# EAGLE schematic controller (EAGLE 6.6.0)
AUTHOR: Branden Ghena; REV: B; TITLE: Signpost Control Module

## Sheet 1 of 5
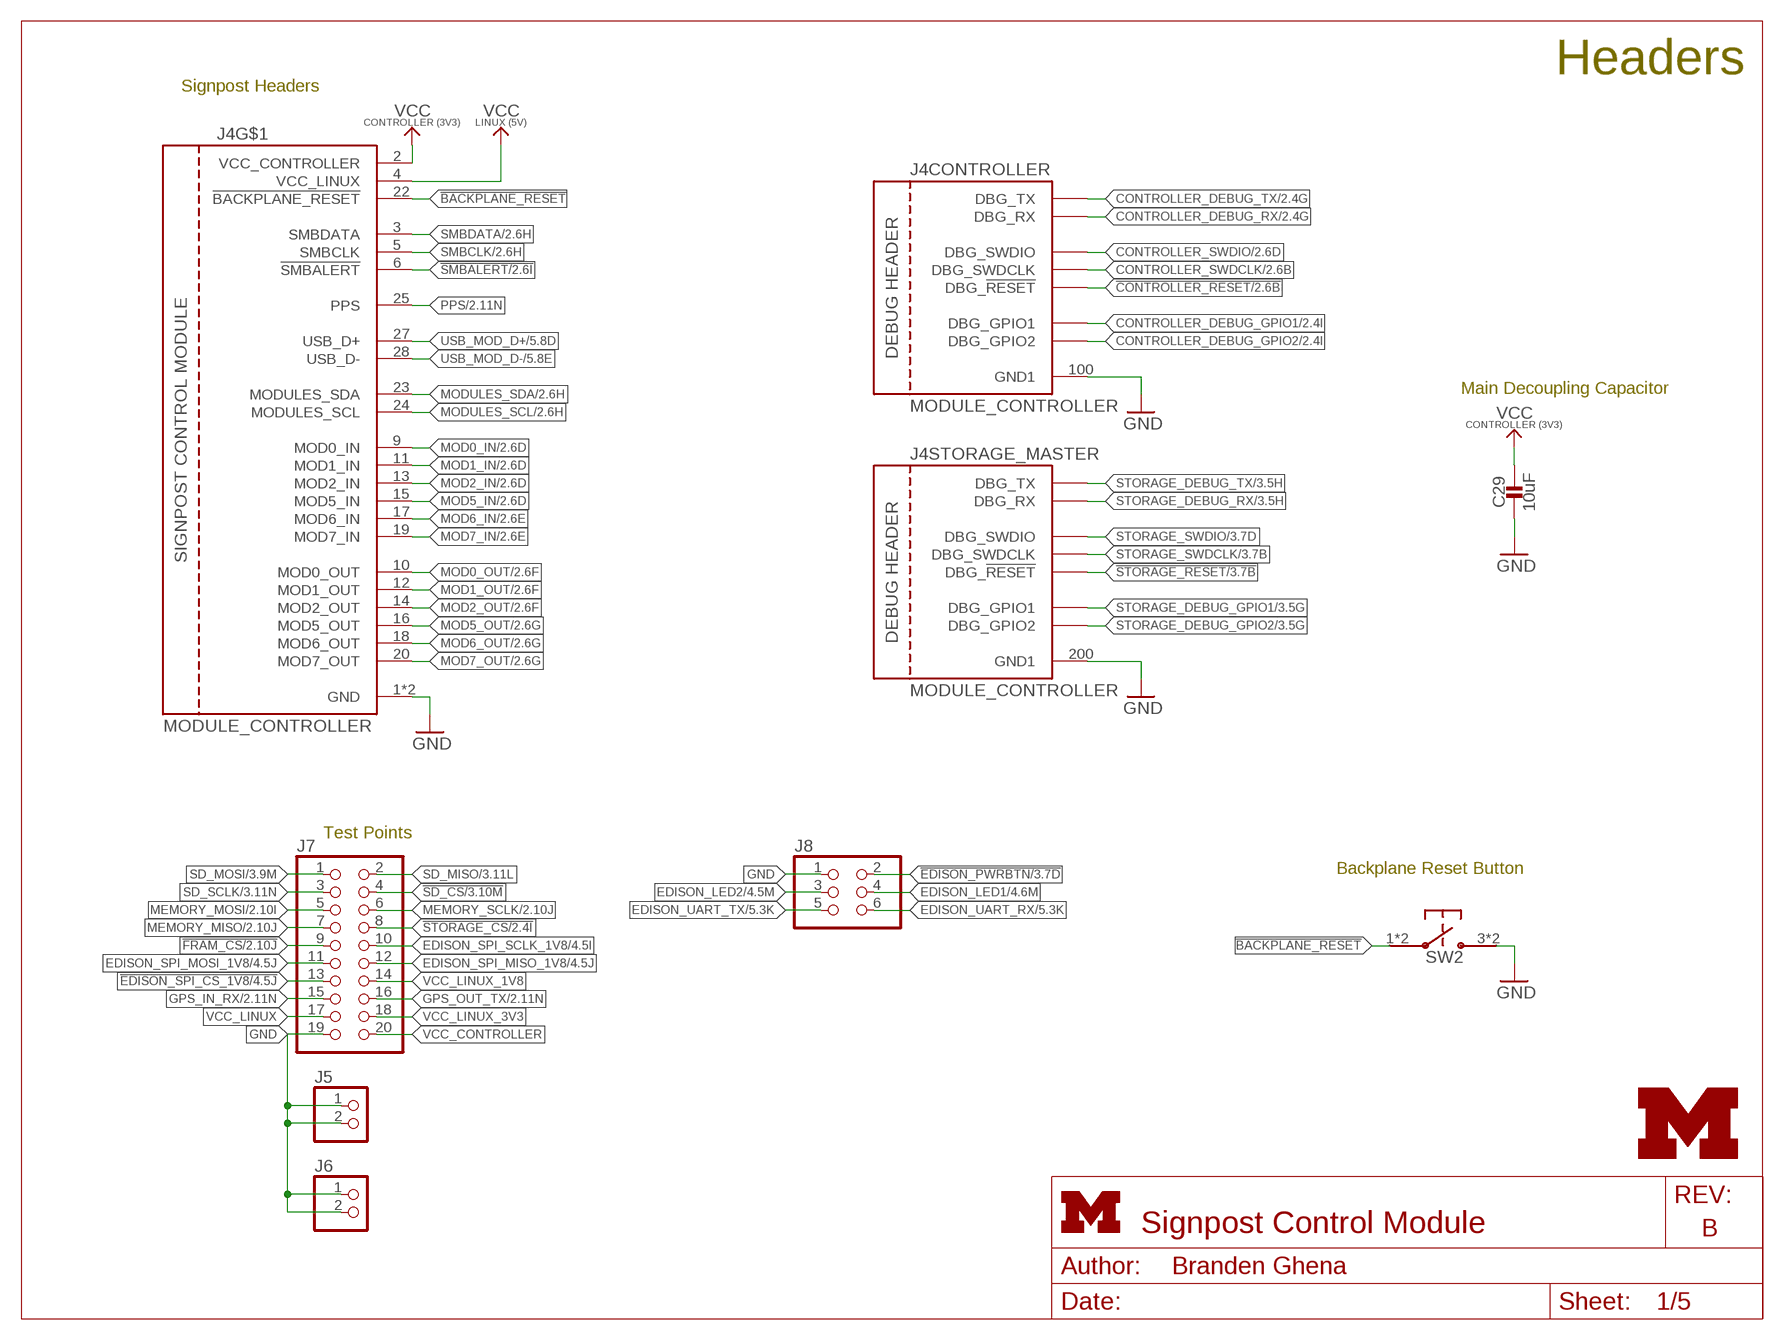
[diagram p0: schematic, sheet 1]
FRAME1 (LETTER_L): HEIGHT: 8.5in; WIDTH: 11in

### Parts
C29  10uF  CAPACITOR0402_CAP  [0402_CAP]
J4  MODULE_CONTROLLER  [MODULE_CONTROLLER]
J5  PINHD-1X2  [1X02]
J6  PINHD-1X2  [1X02]
J7  PINHD-2X10  [2X10]
J8  PINHD-2X3  [2X03]
LOGO1  UMICH_SOLID_MEDIUM  [UMICH_SOLID_200MIL]
SW2  PTS810SJ  [PTS810SJ]

### Nets
!BACKPLANE_RESET: J4.22(!BACKPLANE_RESET) SW2.1 SW2.2
!CONTROLLER_RESET: J4.105(CONTROLLER:DBG_!RESET) ; also sheet 2
!EDISON_PWRBTN: J8.2 ; also sheet 3,4
!EDISON_SPI_CS_1V8: J7.13 ; also sheet 4
!FRAM_CS: J7.9 ; also sheet 2
!SD_CS: J7.4 ; also sheet 3
!SMBALERT: J4.6(!SMBALERT) ; also sheet 2
!STORAGE_CS: J7.8 ; also sheet 2,3
!STORAGE_RESET: J4.205(STORAGE_MASTER:DBG_!RESET) ; also sheet 3
CONTROLLER_DEBUG_GPIO1: J4.101(CONTROLLER:DBG_GPIO1) ; also sheet 2
CONTROLLER_DEBUG_GPIO2: J4.104(CONTROLLER:DBG_GPIO2) ; also sheet 2
CONTROLLER_DEBUG_RX: J4.103(CONTROLLER:DBG_RX) ; also sheet 2
CONTROLLER_DEBUG_TX: J4.102(CONTROLLER:DBG_TX) ; also sheet 2
CONTROLLER_SWDCLK: J4.106(CONTROLLER:DBG_SWDCLK) ; also sheet 2
CONTROLLER_SWDIO: J4.107(CONTROLLER:DBG_SWDIO) ; also sheet 2
EDISON_LED1: J8.4 ; also sheet 4
EDISON_LED2: J8.3 ; also sheet 4
EDISON_SPI_MISO_1V8: J7.12 ; also sheet 4
EDISON_SPI_MOSI_1V8: J7.11 ; also sheet 4
EDISON_SPI_SCLK_1V8: J7.10 ; also sheet 4
EDISON_UART_RX: J8.6 ; also sheet 5
EDISON_UART_TX: J8.5 ; also sheet 5
GND: C29.2 J4.1(GND) J4.21(GND) J4.100(CONTROLLER:GND1) J4.200(STORAGE_MASTER:GND1) J5.1 J5.2 J6.1 J6.2 J7.19 J8.1 SW2.3 SW2.4 ; also sheet 2,3,4,5
GPS_IN_RX: J7.15 ; also sheet 2
GPS_OUT_TX: J7.16 ; also sheet 2
MEMORY_MISO: J7.7 ; also sheet 2,3
MEMORY_MOSI: J7.5 ; also sheet 2,3
MEMORY_SCLK: J7.6 ; also sheet 2,3
MOD0_IN: J4.9(MOD0_IN) ; also sheet 2
MOD0_OUT: J4.10(MOD0_OUT) ; also sheet 2
MOD1_IN: J4.11(MOD1_IN) ; also sheet 2
MOD1_OUT: J4.12(MOD1_OUT) ; also sheet 2
MOD2_IN: J4.13(MOD2_IN) ; also sheet 2
MOD2_OUT: J4.14(MOD2_OUT) ; also sheet 2
MOD5_IN: J4.15(MOD5_IN) ; also sheet 2
MOD5_OUT: J4.16(MOD5_OUT) ; also sheet 2
MOD6_IN: J4.17(MOD6_IN) ; also sheet 2
MOD6_OUT: J4.18(MOD6_OUT) ; also sheet 2
MOD7_IN: J4.19(MOD7_IN) ; also sheet 2
MOD7_OUT: J4.20(MOD7_OUT) ; also sheet 2
MODULES_SCL: J4.24(MODULES_SCL) ; also sheet 2,3,4
MODULES_SDA: J4.23(MODULES_SDA) ; also sheet 2,3,4
PPS: J4.25(PPS) ; also sheet 2
SD_MISO: J7.2 ; also sheet 3
SD_MOSI: J7.1 ; also sheet 3
SD_SCLK: J7.3 ; also sheet 3
SMBCLK: J4.5(SMBCLK) ; also sheet 2
SMBDATA: J4.3(SMBDATA) ; also sheet 2
STORAGE_DEBUG_GPIO1: J4.201(STORAGE_MASTER:DBG_GPIO1) ; also sheet 3
STORAGE_DEBUG_GPIO2: J4.204(STORAGE_MASTER:DBG_GPIO2) ; also sheet 3
STORAGE_DEBUG_RX: J4.203(STORAGE_MASTER:DBG_RX) ; also sheet 3
STORAGE_DEBUG_TX: J4.202(STORAGE_MASTER:DBG_TX) ; also sheet 3
STORAGE_SWDCLK: J4.206(STORAGE_MASTER:DBG_SWDCLK) ; also sheet 3
STORAGE_SWDIO: J4.207(STORAGE_MASTER:DBG_SWDIO) ; also sheet 3
USB_MOD_D+: J4.27(USB_D+) ; also sheet 5
USB_MOD_D-: J4.28(USB_D-) ; also sheet 5
VCC_CONTROLLER: C29.1 J4.2(VCC_CONTROLLER) J7.20 ; also sheet 2,3
VCC_LINUX: J4.4(VCC_LINUX) J7.17 ; also sheet 4,5
VCC_LINUX_1V8: J7.14 ; also sheet 4,5
VCC_LINUX_3V3: J7.18 ; also sheet 4,5

### Notes on the sheet
- Headers
- Signpost Headers
- Main Decoupling Capacitor
- Test Points
- Backplane Reset Button

## Sheet 2 of 5
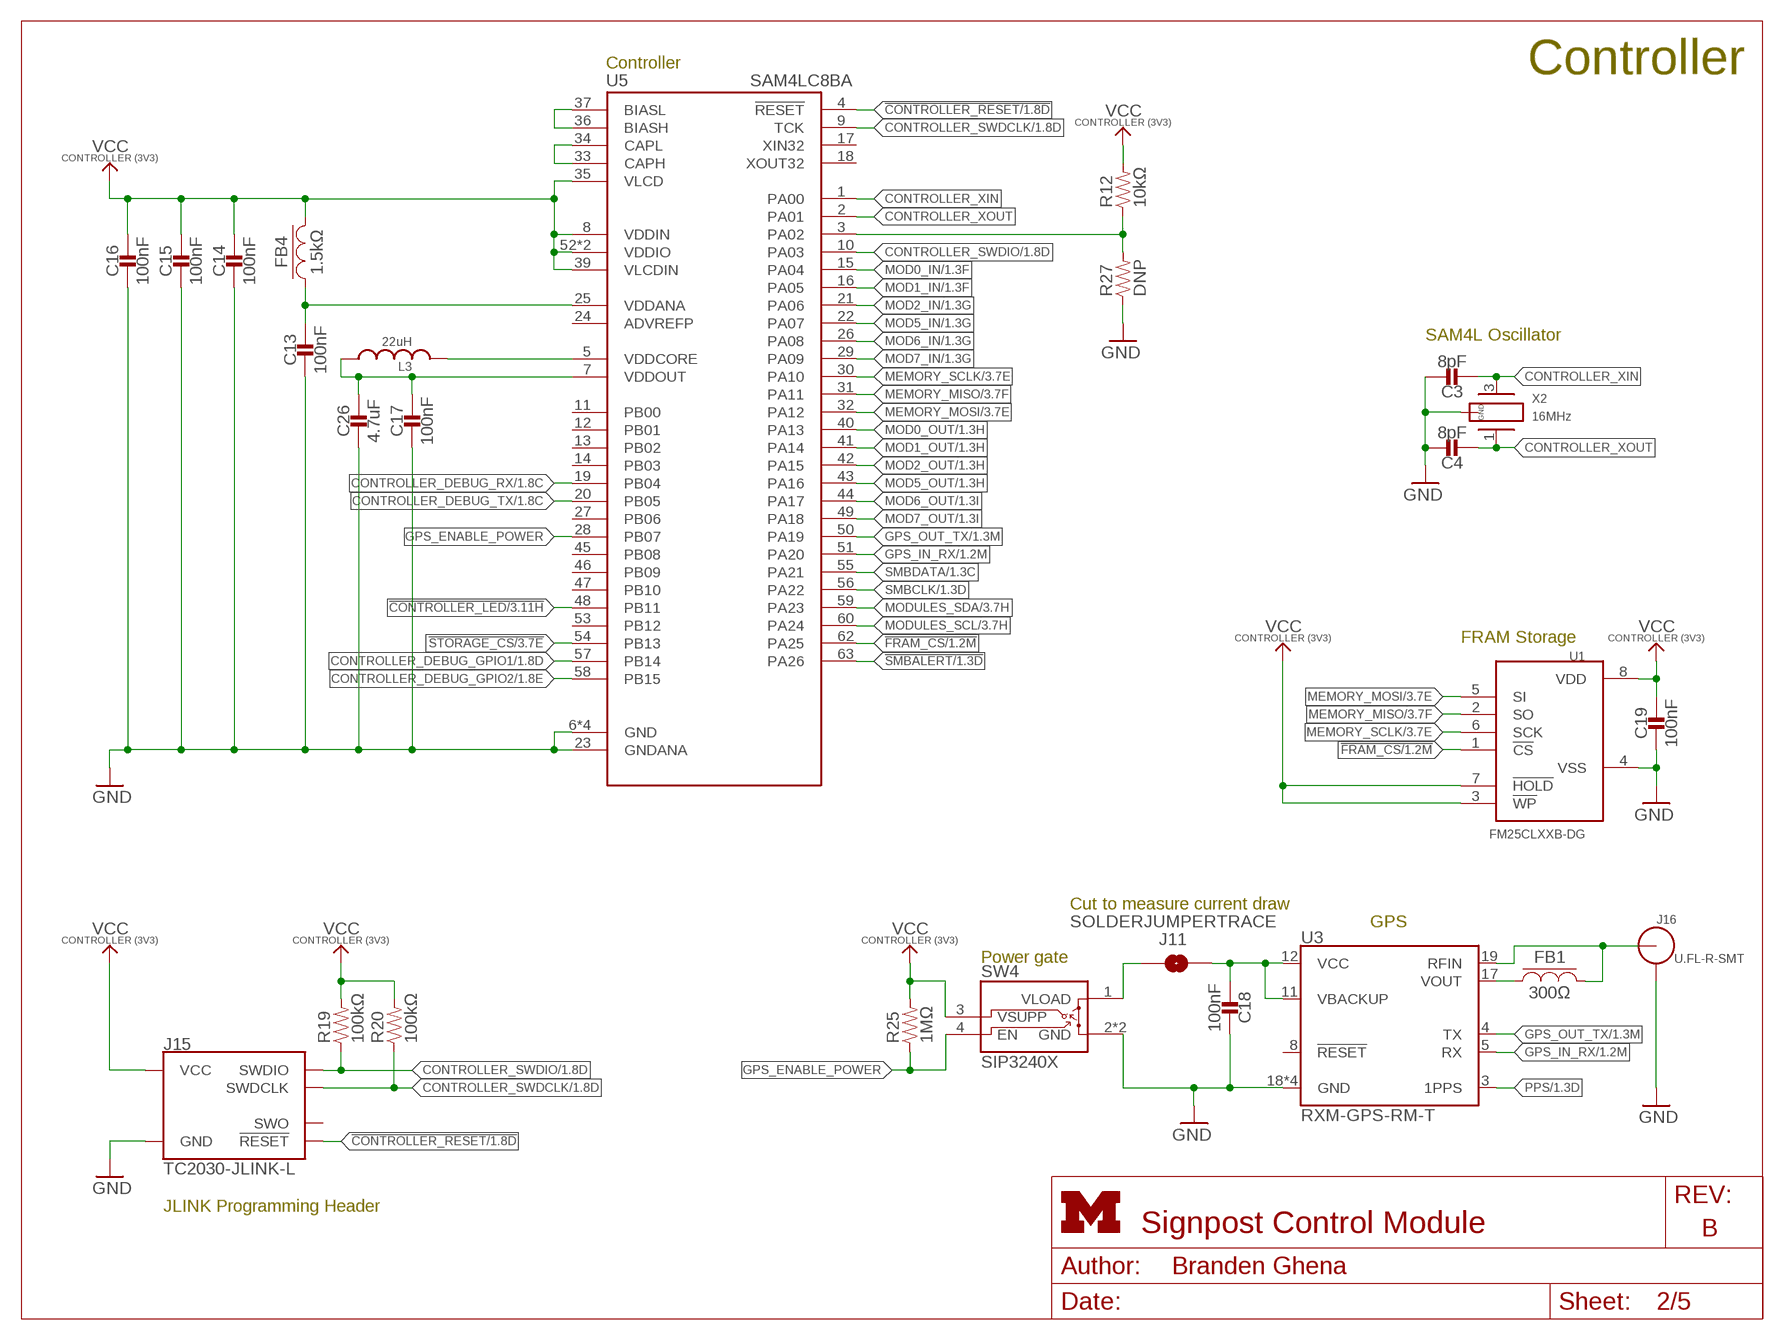
[diagram p1: schematic, sheet 2]
FRAME3 (LETTER_L): HEIGHT: 8.5in; WIDTH: 11in

### Parts
C3  8pF  CAPACITOR0402_CAP  [0402_CAP]
C4  8pF  CAPACITOR0402_CAP  [0402_CAP]
C13  100nF  CAPACITOR0402_CAP  [0402_CAP]
C14  100nF  CAPACITOR0402_CAP  [0402_CAP]
C15  100nF  CAPACITOR0402_CAP  [0402_CAP]
C16  100nF  CAPACITOR0402_CAP  [0402_CAP]
C17  100nF  CAPACITOR0402_CAP  [0402_CAP]
C18  100nF  CAPACITOR0402_CAP  [0402_CAP]
C19  100nF  CAPACITOR0402_CAP  [0402_CAP]
C26  4.7uF  CAPACITOR0402_CAP  [0402_CAP]
FB1  300Ω  FERRITE_BEAD0402  [0402_CAP]
FB4  1.5kΩ  FERRITE_BEAD0402  [0402_CAP]
J11  SOLDERJUMPERTRACE  [SJ_2S-TRACE]
J15  TC2030-JLINK-L  [TC2030-IDC]
J16  U.FL-R-SMT  [U.FL_SMT]
L3  22uH  LHQ3NP  [1212]
R12  10kΩ  RESISTOR0402_RES  [0402_RES]
R19  100kΩ  RESISTOR0402_RES  [0402_RES]
R20  100kΩ  RESISTOR0402_RES  [0402_RES]
R25  1MΩ  RESISTOR0402_RES  [0402_RES]
R27  DNP  RESISTOR0402_RES  [0402_RES]
SW4  SIP3240X  [TDFN4]
U1  FM25CLXXB-DG  [TDFN-8]
U3  RXM-GPS-RM-T  [RXM-GPS-RM-T]
U5  SAM4LC8BA  [QFN-64-9MM]
X2  16MHz  FH1600015  [FHXXX]

### Nets
!CONTROLLER_LED: U5.48(PB11) ; also sheet 3
!CONTROLLER_RESET: J15.3(!RESET) U5.4(!RESET) ; also sheet 1
!FRAM_CS: U1.1(!CS) U5.62(PA25) ; also sheet 1
!SMBALERT: U5.63(PA26) ; also sheet 1
!STORAGE_CS: U5.54(PB13) ; also sheet 1,3
CONTROLLER_BUCK/LDO_N: R12.1 R27.2 U5.3(PA02)
CONTROLLER_DEBUG_GPIO1: U5.57(PB14) ; also sheet 1
CONTROLLER_DEBUG_GPIO2: U5.58(PB15) ; also sheet 1
CONTROLLER_DEBUG_RX: U5.19(PB04) ; also sheet 1
CONTROLLER_DEBUG_TX: U5.20(PB05) ; also sheet 1
CONTROLLER_SWDCLK: J15.4(SWDCLK) R20.1 U5.9(TCK) ; also sheet 1
CONTROLLER_SWDIO: J15.2(SWDIO) R19.1 U5.10(PA03) ; also sheet 1
CONTROLLER_XIN: C3.1 U5.1(PA00) X2.3
CONTROLLER_XOUT: C4.1 U5.2(PA01) X2.1
GND: C3.2 C4.2 C13.2 C14.2 C15.2 C16.2 C17.2 C18.2 C19.2 C26.2 J15.5(GND) J16.GND1 J16.GND2 R27.1 SW4.2(GND) SW4.PAD(GND) U1.4(VSS) U3.18(GND) U3.20(GND) U3.21(GND) U3.22(GND) U5.6(GND) U5.23(GNDANA) U5.38(GND) U5.64(GND) U5.GND X2.2(GND) X2.4(GND) ; also sheet 1,3,4,5
GPS_ENABLE_POWER: R25.1 SW4.4(EN) U5.28(PB07)
GPS_IN_RX: U3.5(RX) U5.51(PA20) ; also sheet 1
GPS_OUT_TX: U3.4(TX) U5.50(PA19) ; also sheet 1
MEMORY_MISO: U1.2(SO) U5.31(PA11) ; also sheet 1,3
MEMORY_MOSI: U1.5(SI) U5.32(PA12) ; also sheet 1,3
MEMORY_SCLK: U1.6(SCK) U5.30(PA10) ; also sheet 1,3
MOD0_IN: U5.15(PA04) ; also sheet 1
MOD0_OUT: U5.40(PA13) ; also sheet 1
MOD1_IN: U5.16(PA05) ; also sheet 1
MOD1_OUT: U5.41(PA14) ; also sheet 1
MOD2_IN: U5.21(PA06) ; also sheet 1
MOD2_OUT: U5.42(PA15) ; also sheet 1
MOD5_IN: U5.22(PA07) ; also sheet 1
MOD5_OUT: U5.43(PA16) ; also sheet 1
MOD6_IN: U5.26(PA08) ; also sheet 1
MOD6_OUT: U5.44(PA17) ; also sheet 1
MOD7_IN: U5.29(PA09) ; also sheet 1
MOD7_OUT: U5.49(PA18) ; also sheet 1
MODULES_SCL: U5.60(PA24) ; also sheet 1,3,4
MODULES_SDA: U5.59(PA23) ; also sheet 1,3,4
N$1: FB1.1 U3.17(VOUT)
N$3: FB1.2 J16.SIG(ANT) U3.19(RFIN)
N$19: J11.1 SW4.1(VLOAD)
N$32: C13.1 FB4.1 U5.25(VDDANA)
N$44: C17.1 C26.1 L3.P$1 U5.7(VDDOUT)
N$53: U5.36(BIASH) U5.37(BIASL)
N$54: U5.33(CAPH) U5.34(CAPL)
N$56: C18.1 J11.2 U3.11(VBACKUP) U3.12(VCC)
N$59: L3.P$2 U5.5(VDDCORE)
PPS: U3.3(1PPS) ; also sheet 1
SMBCLK: U5.56(PA22) ; also sheet 1
SMBDATA: U5.55(PA21) ; also sheet 1
VCC_CONTROLLER: C14.1 C15.1 C16.1 C19.1 FB4.2 J15.1(VCC) R12.2 R19.2 R20.2 R25.2 SW4.3(VSUPP) U1.3(!WP) U1.7(!HOLD) U1.8(VDD) U5.8(VDDIN) U5.35(VLCD) U5.39(VLCDIN) U5.52(VDDIO) U5.61(VDDIO) ; also sheet 1,3
Unconnected: J15.6(SWO) U3.8(!RESET) U5.11(PB00) U5.12(PB01) U5.13(PB02) U5.14(PB03) U5.17(XIN32) U5.18(XOUT32) U5.24(ADVREFP) U5.27(PB06) U5.45(PB08) U5.46(PB09) U5.47(PB10) U5.53(PB12)

### Notes on the sheet
- Controller
- Controller
- SAM4L Oscillator
- FRAM Storage
- Cut to measure current draw
- GPS
- Power gate
- JLINK Programming Header

## Sheet 3 of 5
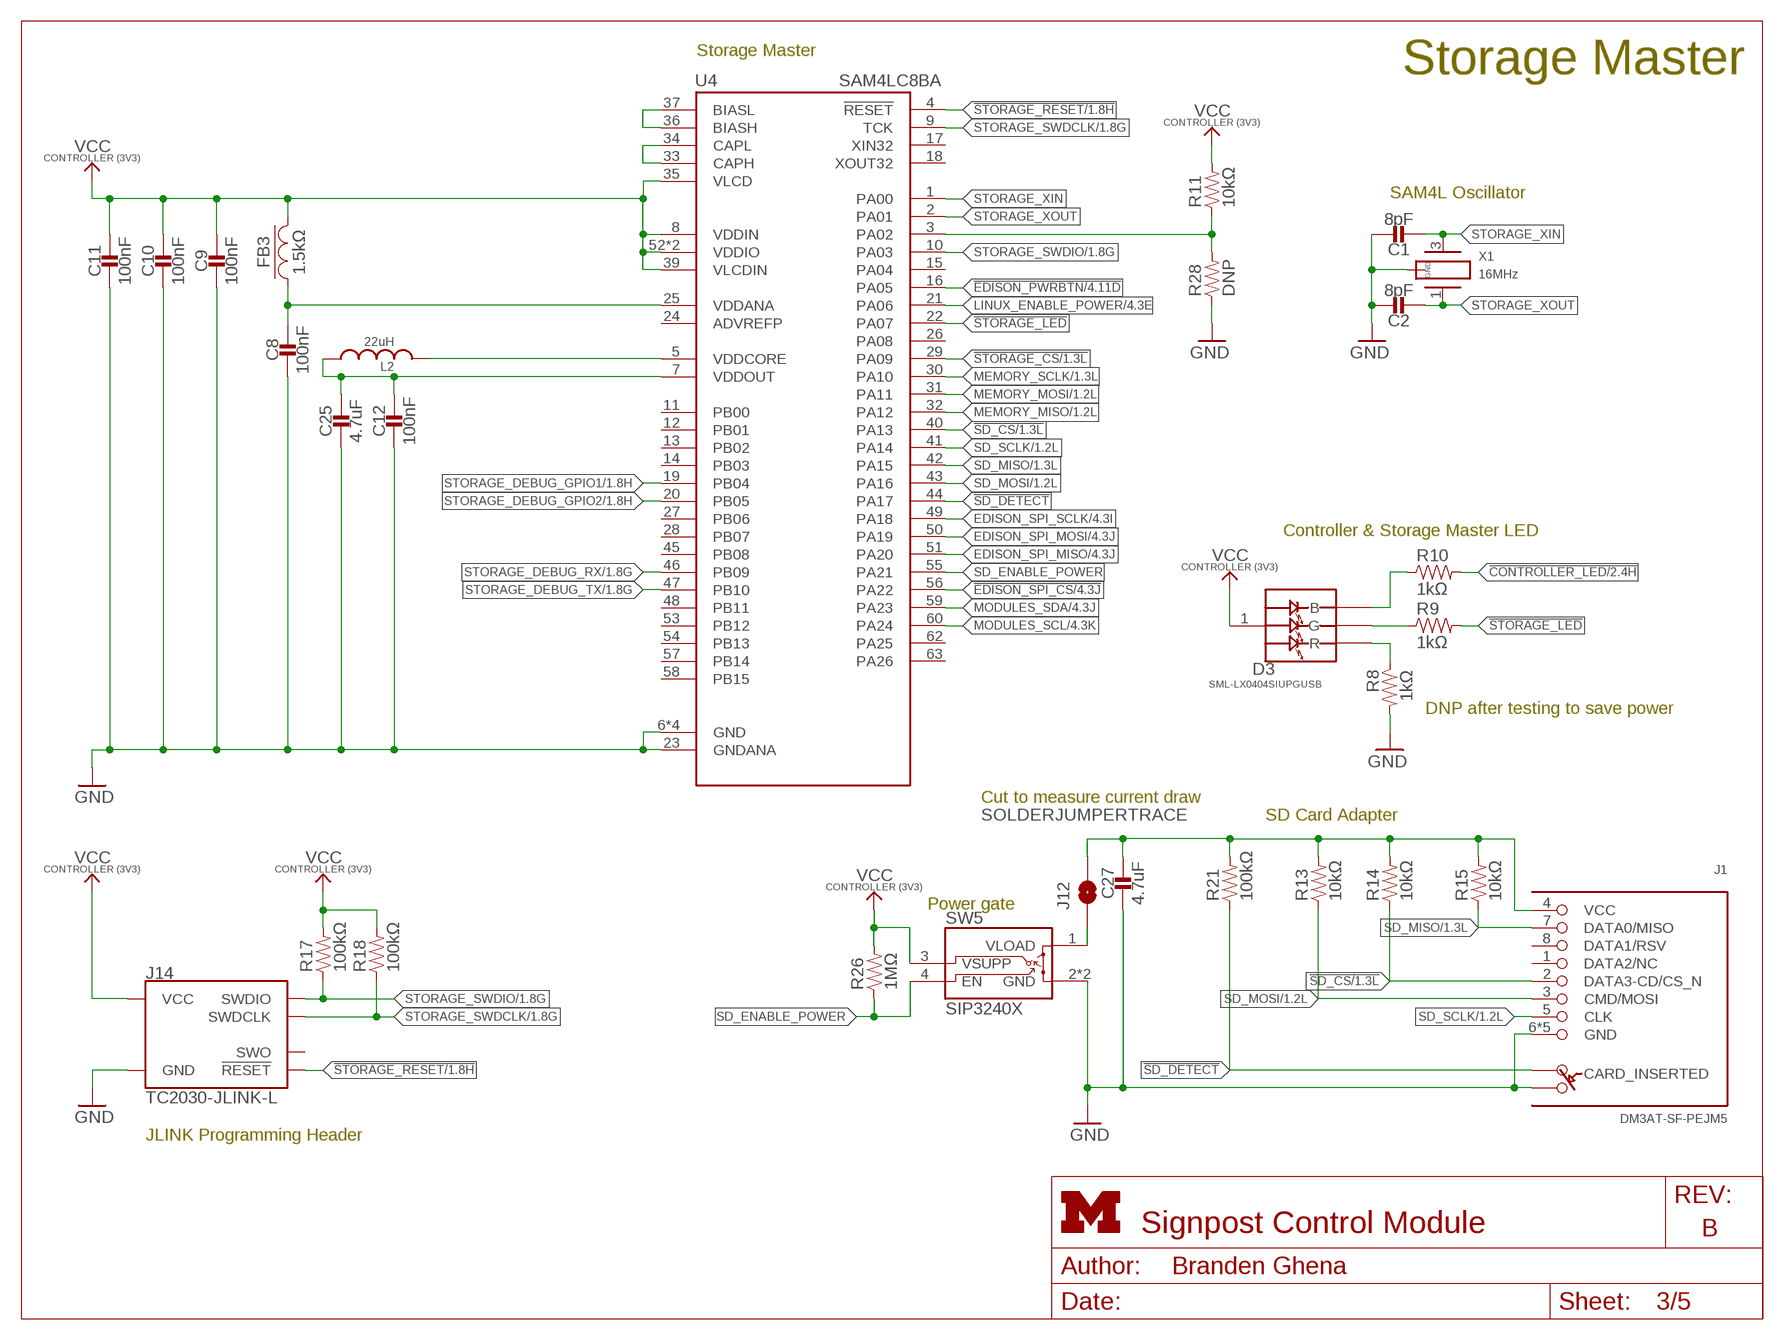
[diagram p2: schematic, sheet 3]
FRAME4 (LETTER_L): HEIGHT: 8.5in; WIDTH: 11in

### Parts
C1  8pF  CAPACITOR0402_CAP  [0402_CAP]
C2  8pF  CAPACITOR0402_CAP  [0402_CAP]
C8  100nF  CAPACITOR0402_CAP  [0402_CAP]
C9  100nF  CAPACITOR0402_CAP  [0402_CAP]
C10  100nF  CAPACITOR0402_CAP  [0402_CAP]
C11  100nF  CAPACITOR0402_CAP  [0402_CAP]
C12  100nF  CAPACITOR0402_CAP  [0402_CAP]
C25  4.7uF  CAPACITOR0402_CAP  [0402_CAP]
C27  4.7uF  CAPACITOR0402_CAP  [0402_CAP]
D3  SML-LX0404SIUPGUSB  [1MM_SQ_4PAD]
FB3  1.5kΩ  FERRITE_BEAD0402  [0402_CAP]
J1  DM3AT-SF-PEJM5  [DM3AT-SF-PEJM5]
J12  SOLDERJUMPERTRACE  [SJ_2S-TRACE]
J14  TC2030-JLINK-L  [TC2030-IDC]
L2  22uH  LHQ3NP  [1212]
R8  1kΩ  RESISTOR0402_RES  [0402_RES]
R9  1kΩ  RESISTOR0402_RES  [0402_RES]
R10  1kΩ  RESISTOR0402_RES  [0402_RES]
R11  10kΩ  RESISTOR0402_RES  [0402_RES]
R13  10kΩ  RESISTOR0402_RES  [0402_RES]
R14  10kΩ  RESISTOR0402_RES  [0402_RES]
R15  10kΩ  RESISTOR0402_RES  [0402_RES]
R17  100kΩ  RESISTOR0402_RES  [0402_RES]
R18  100kΩ  RESISTOR0402_RES  [0402_RES]
R21  100kΩ  RESISTOR0402_RES  [0402_RES]
R26  1MΩ  RESISTOR0402_RES  [0402_RES]
R28  DNP  RESISTOR0402_RES  [0402_RES]
SW5  SIP3240X  [TDFN4]
U4  SAM4LC8BA  [QFN-64-9MM]
X1  16MHz  FH1600015  [FHXXX]

### Nets
!CONTROLLER_LED: R10.2 ; also sheet 2
!EDISON_PWRBTN: U4.16(PA05) ; also sheet 1,4
!EDISON_SPI_CS: U4.56(PA22) ; also sheet 4
!SD_CS: J1.2(DATA3-CD/CS_N) R14.1 U4.40(PA13) ; also sheet 1
!SD_DETECT: J1.A R21.1 U4.44(PA17)
!STORAGE_CS: U4.29(PA09) ; also sheet 1,2
!STORAGE_LED: R9.2 U4.22(PA07)
!STORAGE_RESET: J14.3(!RESET) U4.4(!RESET) ; also sheet 1
EDISON_SPI_MISO: U4.51(PA20) ; also sheet 4
EDISON_SPI_MOSI: U4.50(PA19) ; also sheet 4
EDISON_SPI_SCLK: U4.49(PA18) ; also sheet 4
GND: C1.2 C2.2 C8.2 C9.2 C10.2 C11.2 C12.2 C25.2 C27.2 J1.6(GND) J1.B J1.MOUNT0(GND) J1.MOUNT1(GND) J1.MOUNT2(GND) J1.MOUNT3(GND) J14.5(GND) R8.2 R28.1 SW5.2(GND) SW5.PAD(GND) U4.6(GND) U4.23(GNDANA) U4.38(GND) U4.64(GND) U4.GND X1.2(GND) X1.4(GND) ; also sheet 1,2,4,5
LINUX_ENABLE_POWER: U4.21(PA06) ; also sheet 4
MEMORY_MISO: U4.32(PA12) ; also sheet 1,2
MEMORY_MOSI: U4.31(PA11) ; also sheet 1,2
MEMORY_SCLK: U4.30(PA10) ; also sheet 1,2
MODULES_SCL: U4.60(PA24) ; also sheet 1,2,4
MODULES_SDA: U4.59(PA23) ; also sheet 1,2,4
N$7: D3.2(R) R8.1
N$8: D3.4(G) R9.1
N$9: D3.3(B) R10.1
N$18: J12.1 SW5.1(VLOAD)
N$29: C8.1 FB3.1 U4.25(VDDANA)
N$45: C12.1 C25.1 L2.P$1 U4.7(VDDOUT)
N$46: L2.P$2 U4.5(VDDCORE)
N$48: U4.33(CAPH) U4.34(CAPL)
N$51: U4.36(BIASH) U4.37(BIASL)
N$58: C27.1 J1.4(VCC) J12.2 R13.2 R14.2 R15.2 R21.2
SD_ENABLE_POWER: R26.1 SW5.4(EN) U4.55(PA21)
SD_MISO: J1.7(DATA0/MISO) R15.1 U4.42(PA15) ; also sheet 1
SD_MOSI: J1.3(CMD/MOSI) R13.1 U4.43(PA16) ; also sheet 1
SD_SCLK: J1.5(CLK) U4.41(PA14) ; also sheet 1
STORAGE_BUCK/LDO_N: R11.1 R28.2 U4.3(PA02)
STORAGE_DEBUG_GPIO1: U4.19(PB04) ; also sheet 1
STORAGE_DEBUG_GPIO2: U4.20(PB05) ; also sheet 1
STORAGE_DEBUG_RX: U4.46(PB09) ; also sheet 1
STORAGE_DEBUG_TX: U4.47(PB10) ; also sheet 1
STORAGE_SWDCLK: J14.4(SWDCLK) R18.1 U4.9(TCK) ; also sheet 1
STORAGE_SWDIO: J14.2(SWDIO) R17.1 U4.10(PA03) ; also sheet 1
STORAGE_XIN: C1.1 U4.1(PA00) X1.3
STORAGE_XOUT: C2.1 U4.2(PA01) X1.1
VCC_CONTROLLER: C9.1 C10.1 C11.1 D3.1(VDD) FB3.2 J14.1(VCC) R11.2 R17.2 R18.2 R26.2 SW5.3(VSUPP) U4.8(VDDIN) U4.35(VLCD) U4.39(VLCDIN) U4.52(VDDIO) U4.61(VDDIO) ; also sheet 1,2
Unconnected: J1.1(DATA2/NC) J1.8(DATA1/RSV) J14.6(SWO) U4.11(PB00) U4.12(PB01) U4.13(PB02) U4.14(PB03) U4.15(PA04) U4.17(XIN32) U4.18(XOUT32) U4.24(ADVREFP) U4.26(PA08) U4.27(PB06) U4.28(PB07) U4.45(PB08) U4.48(PB11) U4.53(PB12) U4.54(PB13) U4.57(PB14) U4.58(PB15) U4.62(PA25) U4.63(PA26)

### Notes on the sheet
- Storage Master
- Storage Master
- SAM4L Oscillator
- Controller & Storage Master LED
- DNP after testing to save power
- Cut to measure current draw
- SD Card Adapter
- Power gate
- JLINK Programming Header

## Sheet 4 of 5
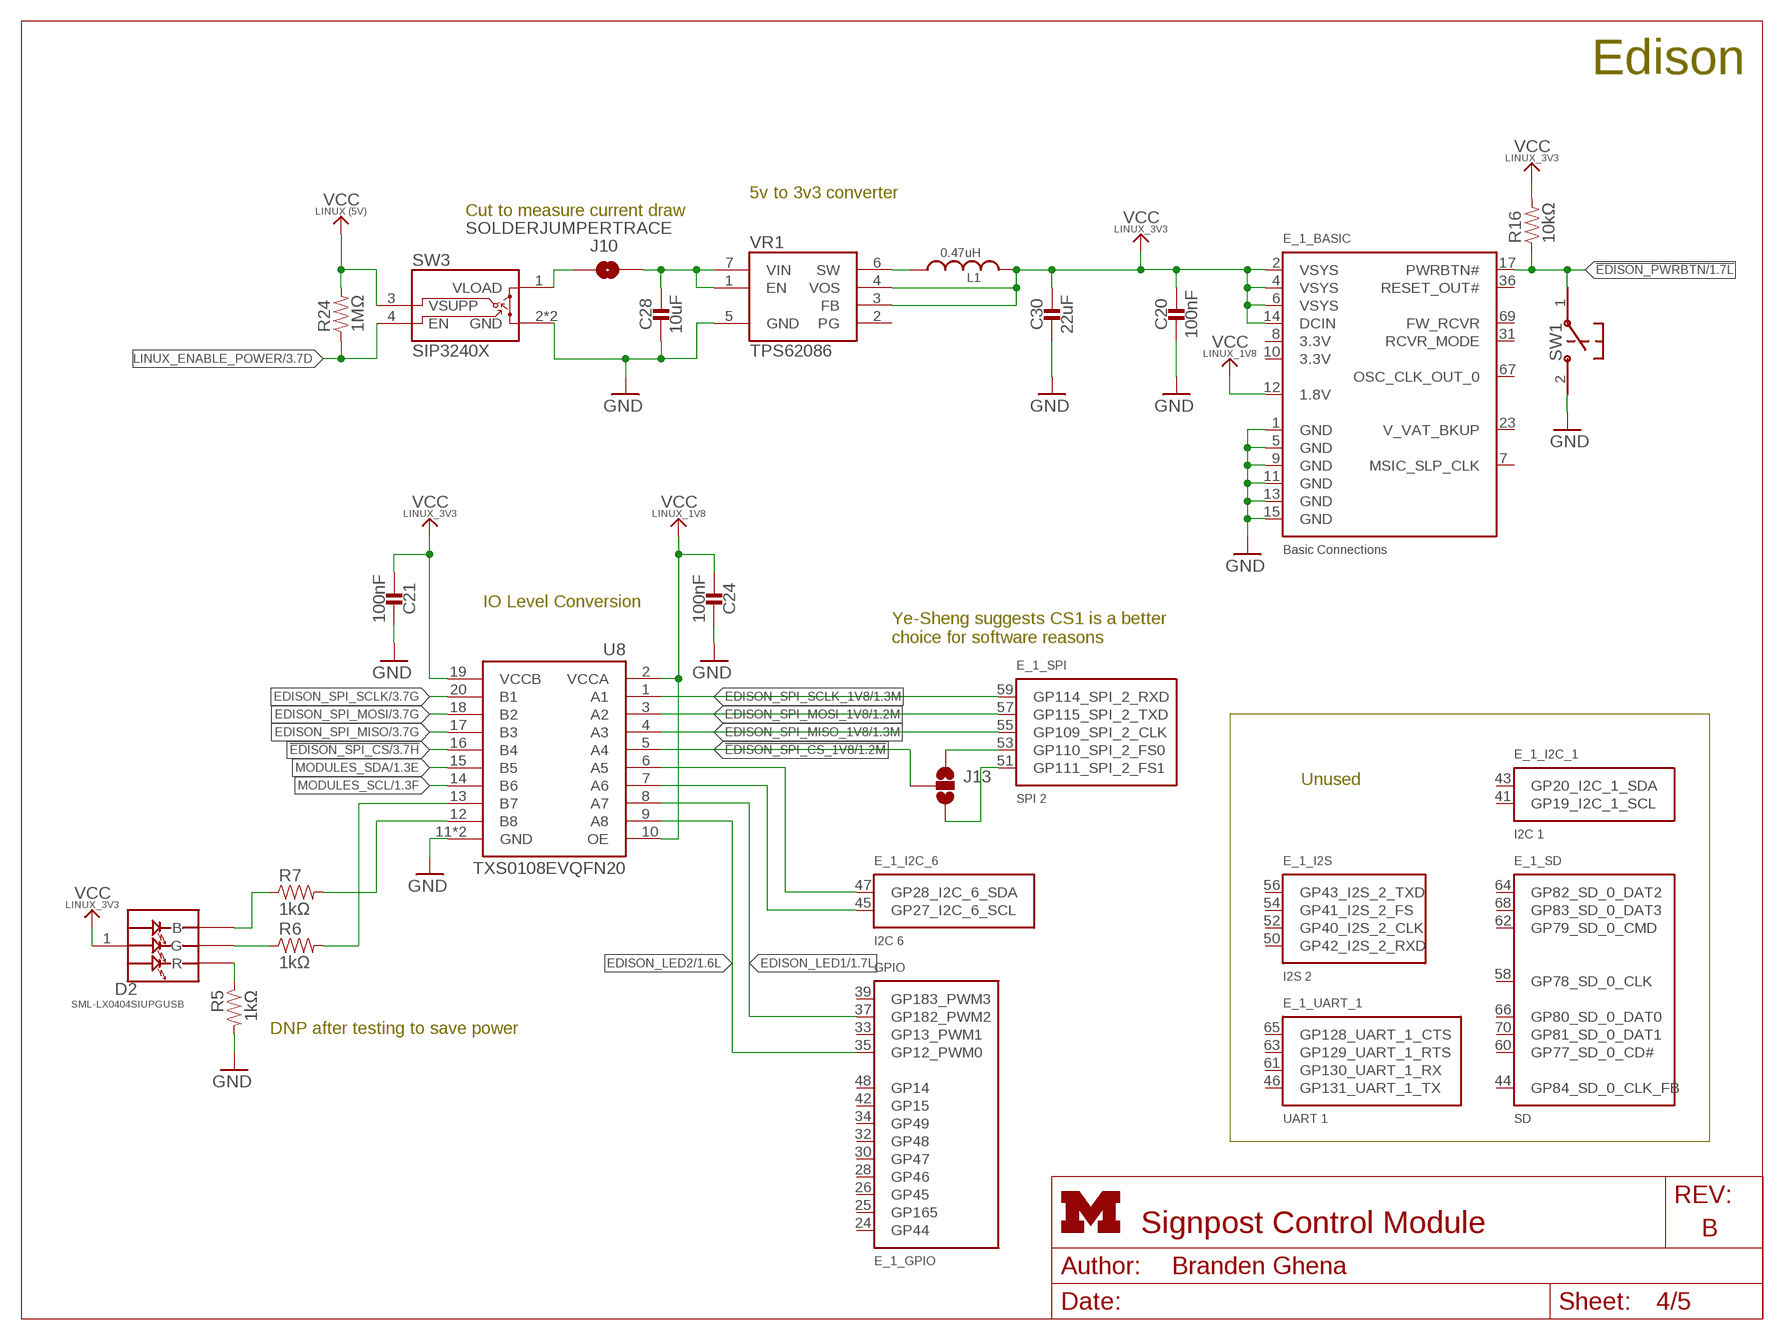
[diagram p3: schematic, sheet 4]
FRAME2 (LETTER_L): HEIGHT: 8.5in; WIDTH: 11in

### Parts
C20  100nF  CAPACITOR0402_CAP  [0402_CAP]
C21  100nF  CAPACITOR0402_CAP  [0402_CAP]
C24  100nF  CAPACITOR0402_CAP  [0402_CAP]
C28  10uF  CAPACITOR0805_CAP  [0805_CAP]
C30  22uF  CAPACITOR0805_CAP  [0805_CAP]
D2  SML-LX0404SIUPGUSB  [1MM_SQ_4PAD]
E_1  EDISON_CONNECTOR_SEGMENTED  [EDISON_DAUGHTER]
J10  SOLDERJUMPERTRACE  [SJ_2S-TRACE]
J13  SOLDERJUMPER_2WAYPASTE2&3  [SJ_3_PASTE2&3]
L1  0.47uH  INDUCTORDFE322512C  [DFE322512C]
R5  1kΩ  RESISTOR0402_RES  [0402_RES]
R6  1kΩ  RESISTOR0402_RES  [0402_RES]
R7  1kΩ  RESISTOR0402_RES  [0402_RES]
R16  10kΩ  RESISTOR0402_RES  [0402_RES]
R24  1MΩ  RESISTOR0402_RES  [0402_RES]
SW1  B3U-1000P  [B3U-1000P]
SW3  SIP3240X  [TDFN4]
U8  TXS0108EVQFN20  [R-PVQFN-N20]
VR1  TPS62086  [RLT0007A]

### Nets
!EDISON_PWRBTN: E_1.17(_BASIC:PWRBTN#) R16.1 SW1.1 ; also sheet 1,3
!EDISON_SPI_CS: U8.16(B4) ; also sheet 3
!EDISON_SPI_CS_1V8: J13.2 U8.5(A4) ; also sheet 1
EDISON_LED1: E_1.37(_GPIO:GP182_PWM2) U8.8(A7) ; also sheet 1
EDISON_LED2: E_1.35(_GPIO:GP12_PWM0) U8.9(A8) ; also sheet 1
EDISON_SPI_MISO: U8.17(B3) ; also sheet 3
EDISON_SPI_MISO_1V8: E_1.55(_SPI:GP109_SPI_2_CLK) U8.4(A3) ; also sheet 1
EDISON_SPI_MOSI: U8.18(B2) ; also sheet 3
EDISON_SPI_MOSI_1V8: E_1.57(_SPI:GP115_SPI_2_TXD) U8.3(A2) ; also sheet 1
EDISON_SPI_SCLK: U8.20(B1) ; also sheet 3
EDISON_SPI_SCLK_1V8: E_1.59(_SPI:GP114_SPI_2_RXD) U8.1(A1) ; also sheet 1
GND: C20.2 C21.1 C24.1 C28.P$2 C30.P$2 E_1.1(_BASIC:GND) E_1.5(_BASIC:GND) E_1.9(_BASIC:GND) E_1.11(_BASIC:GND) E_1.13(_BASIC:GND) E_1.15(_BASIC:GND) R5.2 SW1.2 SW3.2(GND) SW3.PAD(GND) U8.11(GND) U8.THERMAL(GND) VR1.5(GND) ; also sheet 1,2,3,5
LINUX_5V_IN: C28.P$1 J10.2 VR1.1(EN) VR1.7(VIN)
LINUX_ENABLE_POWER: R24.1 SW3.4(EN) ; also sheet 3
MODULES_SCL: U8.14(B6) ; also sheet 1,2,3
MODULES_SCL_1V8: E_1.45(_I2C_6:GP27_I2C_6_SCL) U8.7(A6)
MODULES_SDA: U8.15(B5) ; also sheet 1,2,3
MODULES_SDA_1V8: E_1.47(_I2C_6:GP28_I2C_6_SDA) U8.6(A5)
N$11: E_1.53(_SPI:GP110_SPI_2_FS0) J13.1
N$12: R7.2 U8.12(B8)
N$13: E_1.51(_SPI:GP111_SPI_2_FS1) J13.3
N$14: L1.P$1 VR1.6(SW)
N$16: J10.1 SW3.1(VLOAD)
N$34: D2.2(R) R5.1
N$37: D2.4(G) R6.1
N$38: D2.3(B) R7.1
N$50: R6.2 U8.13(B7)
VCC_LINUX: R24.2 SW3.3(VSUPP) ; also sheet 1,5
VCC_LINUX_1V8: C24.2 E_1.12(_BASIC:1.8V) U8.2(VCCA) U8.10(OE) ; also sheet 1,5
VCC_LINUX_3V3: C20.1 C21.2 C30.P$1 D2.1(VDD) E_1.2(_BASIC:VSYS) E_1.4(_BASIC:VSYS) E_1.6(_BASIC:VSYS) E_1.14(_BASIC:DCIN) L1.P$2 R16.2 U8.19(VCCB) VR1.3(FB) VR1.4(VOS) ; also sheet 1,5
Unconnected: E_1.7(_BASIC:MSIC_SLP_CLK) E_1.8(_BASIC:3.3V) E_1.10(_BASIC:3.3V) E_1.23(_BASIC:V_VAT_BKUP) E_1.24(_GPIO:GP44) E_1.25(_GPIO:GP165) E_1.26(_GPIO:GP45) E_1.28(_GPIO:GP46) E_1.30(_GPIO:GP47) E_1.31(_BASIC:RCVR_MODE) E_1.32(_GPIO:GP48) E_1.33(_GPIO:GP13_PWM1) E_1.34(_GPIO:GP49) E_1.36(_BASIC:RESET_OUT#) E_1.39(_GPIO:GP183_PWM3) E_1.41(_I2C_1:GP19_I2C_1_SCL) E_1.42(_GPIO:GP15) E_1.43(_I2C_1:GP20_I2C_1_SDA) E_1.44(_SD:GP84_SD_0_CLK_FB) E_1.46(_UART_1:GP131_UART_1_TX) E_1.48(_GPIO:GP14) E_1.50(_I2S:GP42_I2S_2_RXD) E_1.52(_I2S:GP40_I2S_2_CLK) E_1.54(_I2S:GP41_I2S_2_FS) E_1.56(_I2S:GP43_I2S_2_TXD) E_1.58(_SD:GP78_SD_0_CLK) E_1.60(_SD:GP77_SD_0_CD#) E_1.61(_UART_1:GP130_UART_1_RX) E_1.62(_SD:GP79_SD_0_CMD) E_1.63(_UART_1:GP129_UART_1_RTS) E_1.64(_SD:GP82_SD_0_DAT2) E_1.65(_UART_1:GP128_UART_1_CTS) E_1.66(_SD:GP80_SD_0_DAT0) E_1.67(_BASIC:OSC_CLK_OUT_0) E_1.68(_SD:GP83_SD_0_DAT3) E_1.69(_BASIC:FW_RCVR) E_1.70(_SD:GP81_SD_0_DAT1) VR1.2(PG)

### Notes on the sheet
- Edison
- 5v to 3v3 converter
- Cut to measure current draw
- IO Level Conversion
- Ye-Sheng suggests CS1 is a better
  choice for software reasons
- Unused
- DNP after testing to save power

## Sheet 5 of 5
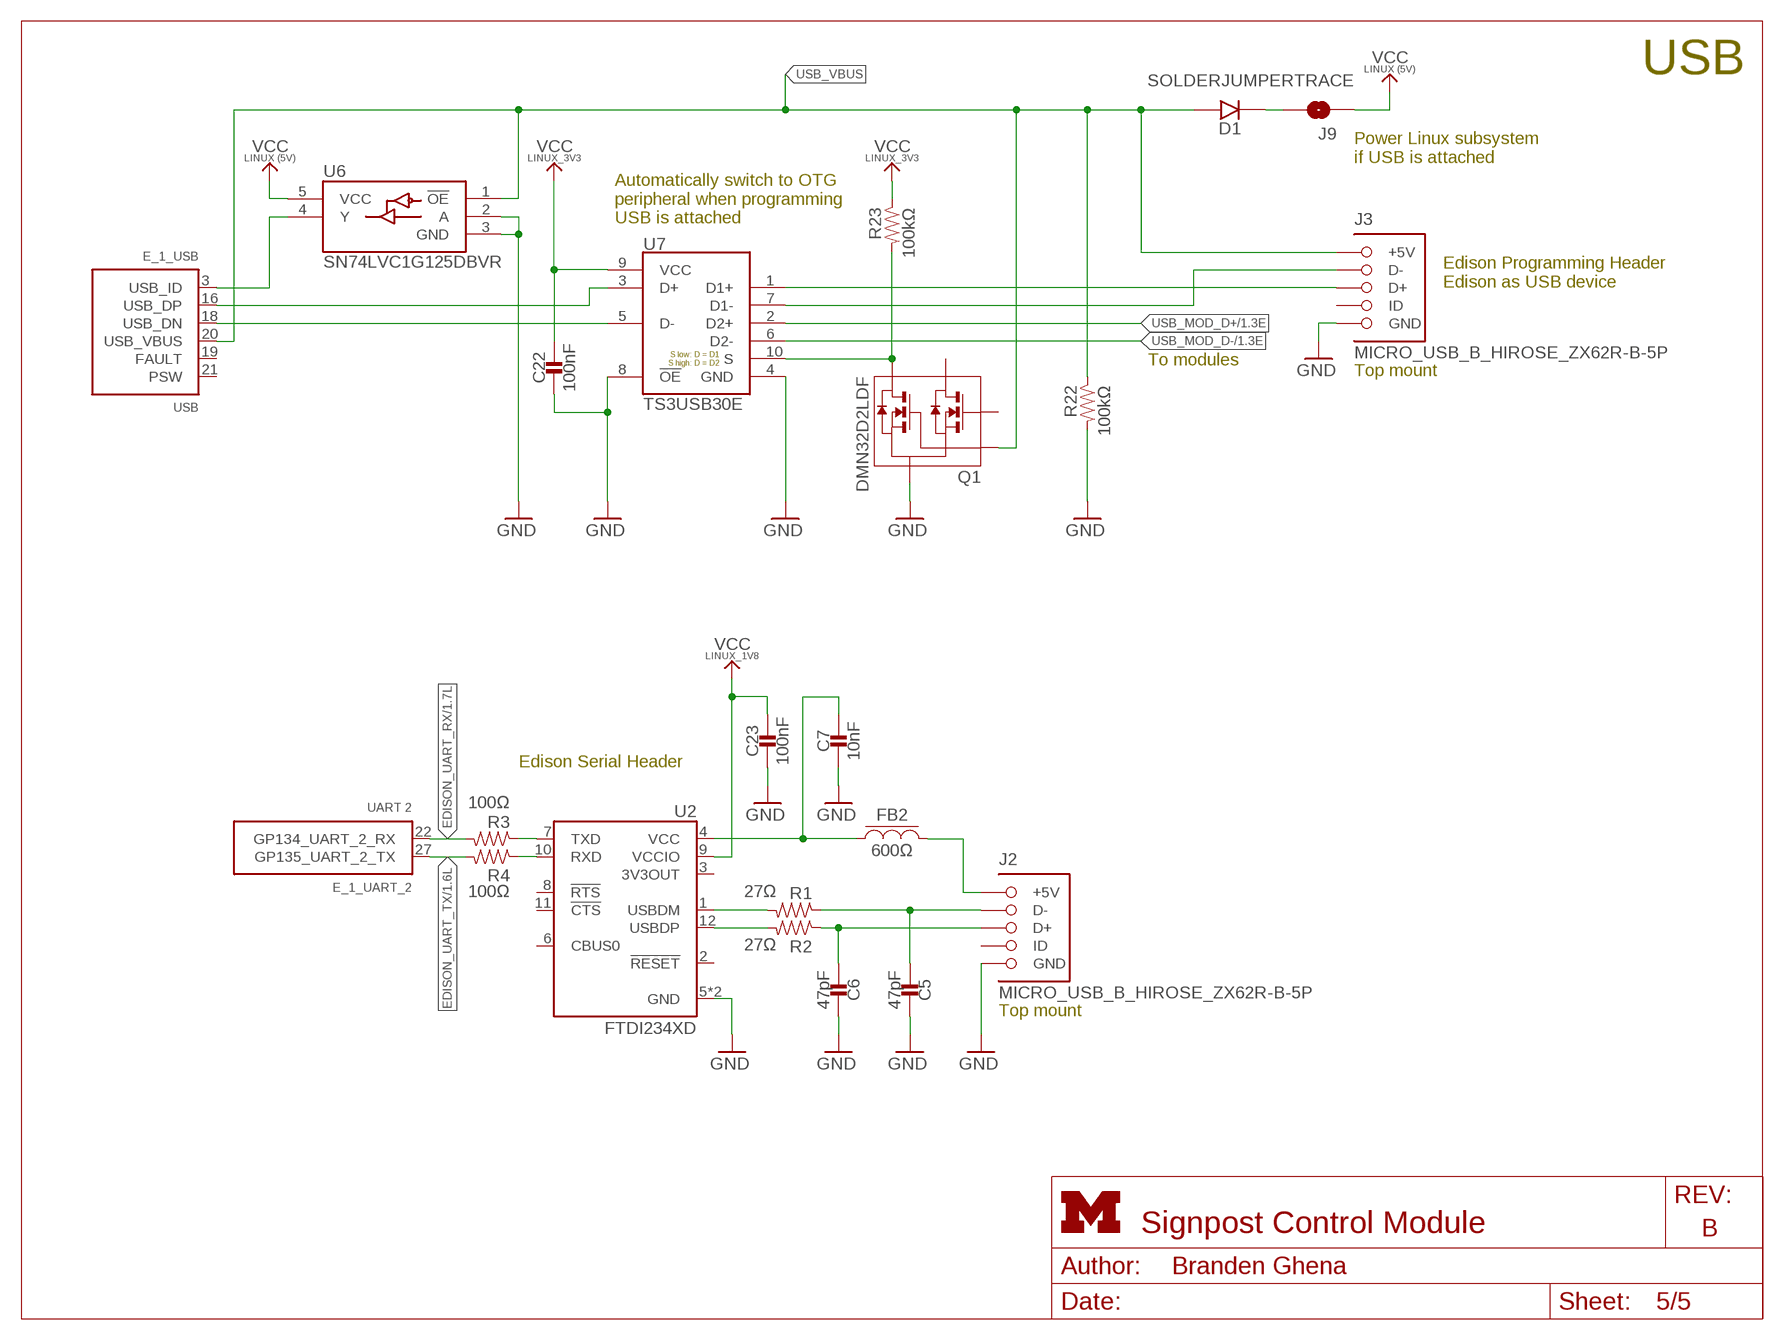
[diagram p4: schematic, sheet 5]
FRAME5 (LETTER_L): HEIGHT: 8.5in; WIDTH: 11in

### Parts
C5  47pF  CAPACITOR0402_CAP  [0402_CAP]
C6  47pF  CAPACITOR0402_CAP  [0402_CAP]
C7  10nF  CAPACITOR0402_CAP  [0402_CAP]
C22  100nF  CAPACITOR0402_CAP  [0402_CAP]
C23  100nF  CAPACITOR0402_CAP  [0402_CAP]
D1  DIODE  [0805_DIODE]
FB2  600Ω  FERRITE_BEAD0805  [0805_CAP]
J2  MICRO_USB_B_HIROSE_ZX62R-B-5P  [USB_MICRO_B-HIROSE-ZX62R-B-5P]
J3  MICRO_USB_B_HIROSE_ZX62R-B-5P  [USB_MICRO_B-HIROSE-ZX62R-B-5P]
J9  SOLDERJUMPERTRACE  [SJ_2S-TRACE]
Q1  DMN32D2LDF  [SOT353]
R1  27Ω  RESISTOR0402_RES  [0402_RES]
R2  27Ω  RESISTOR0402_RES  [0402_RES]
R3  100Ω  RESISTOR0402_RES  [0402_RES]
R4  100Ω  RESISTOR0402_RES  [0402_RES]
R22  100kΩ  RESISTOR0402_RES  [0402_RES]
R23  100kΩ  RESISTOR0402_RES  [0402_RES]
U2  FTDI234XD  [DFN-12/3MM]
U6  SN74LVC1G125DBVR  [SOT-23-5]
U7  TS3USB30E  [UQFN-10]

### Nets
D+: C6.1 J2.3(D+) R2.1
D-: C5.1 J2.2(D-) R1.1
EDISON_UART_RX: E_1.22(_UART_2:GP134_UART_2_RX) R3.2 ; also sheet 1
EDISON_UART_TX: E_1.27(_UART_2:GP135_UART_2_TX) R4.2 ; also sheet 1
GND: C5.2 C6.2 C7.2 C22.2 C23.2 J2.5(GND) J3.5(GND) Q1.S R22.2 U2.5(GND) U2.13(GND) U6.2(A) U6.3(GND) U7.4(GND) U7.8(!OE) ; also sheet 1,2,3,4
N$2: R1.2 U2.1(USBDM)
N$4: R2.2 U2.12(USBDP)
N$5: J3.2(D-) U7.7(D1-)
N$6: J3.3(D+) U7.1(D1+)
N$10: FB2.P$2 J2.1(+5V)
N$15: D1.CATHODE J9.2
N$17: E_1.3(_USB:USB_ID) U6.4(Y)
N$24: R3.1 U2.7(TXD)
N$25: R4.1 U2.10(RXD)
N$28: C7.1 FB2.P$1 U2.4(VCC)
N$30: Q1.D2 R23.2 U7.10(S)
USB_D+: E_1.16(_USB:USB_DP) U7.3(D+)
USB_D-: E_1.18(_USB:USB_DN) U7.5(D-)
USB_MOD_D+: U7.2(D2+) ; also sheet 1
USB_MOD_D-: U7.6(D2-) ; also sheet 1
USB_VBUS: D1.ANODE E_1.20(_USB:USB_VBUS) J3.1(+5V) Q1.G2 R22.1 U6.1(!OE)
VCC_LINUX: J9.1 U6.5(VCC) ; also sheet 1,4
VCC_LINUX_1V8: C23.1 U2.9(VCCIO) ; also sheet 1,4
VCC_LINUX_3V3: C22.1 R23.1 U7.9(VCC) ; also sheet 1,4
Unconnected: E_1.19(_USB:FAULT) E_1.21(_USB:PSW) J2.4(ID) J3.4(ID) Q1.D1 Q1.G1 U2.2(!RESET) U2.3(3V3OUT) U2.6(CBUS0) U2.8(!RTS) U2.11(!CTS)

### Notes on the sheet
- USB
- Power Linux subsystem
  if USB is attached
- Automatically switch to OTG
  peripheral when programming
  USB is attached
- Edison Programming Header
  Edison as USB device
- To modules
- Top mount
- Edison Serial Header
- Top mount

## Library data of the parts
C1-C4 = passives:CAPACITOR: 0402 Capacitor; DIGIKEY: 490-8230-1-ND
C5 C6 = passives:CAPACITOR: 0402 Capacitor; DIGIKEY: 490-6241-1-ND
C7 = passives:CAPACITOR: 0402 Capacitor; DIGIKEY: 490-6296-1-ND
C8-C24 = passives:CAPACITOR: 0402 Capacitor; DIGIKEY: 490-10777-1-ND
C25-C27 = passives:CAPACITOR: 0402 Capacitor; DIGIKEY: 490-13252-1-ND
C28 = passives:CAPACITOR: 0402 Capacitor; DIGIKEY: 490-8316-1-ND
C29 = passives:CAPACITOR: 0402 Capacitor; DIGIKEY: 490-13811-1-ND
C30 = passives:CAPACITOR: 0402 Capacitor; DIGIKEY: 490-1719-1-ND
D1 = passives:DIODE; DIGIKEY: 478-7800-1-ND
D2 D3 = leds:SML-LX0404SIUPGUSB: 1mm^2 RGB LED; DIGIKEY: 67-2125-1-ND
E_1 = Edison:EDISON_CONNECTOR_SEGMENTED; AMAZON: B00PTVSS4A; MOUSER: 798-DF40HC3070DS4V51
FB1 = passives:FERRITE_BEAD; DIGIKEY: ACML-0402-301-TCT-ND
FB2 = passives:FERRITE_BEAD; DIGIKEY: 240-2390-1-ND
FB3 FB4 = passives:FERRITE_BEAD; DIGIKEY: 1276-6395-1-ND
J1 = connector:DM3AT-SF-PEJM5: CONN MICRO SD R/A PUSH-PUSH SMD; DIGIKEY: HR1964CT-ND
J2 J3 = connector:MICRO_USB_B_HIROSE_ZX62R-B-5P: USB Micro B Connector Rounded side is up.; DIGIKEY: H125274CT-ND
J4 = signpost:MODULE_CONTROLLER: Controller module for signpost; DIGIKEY: S9172-ND , S9169-ND , S2221EC-04-ND , S2221EC-04-ND
J5 J6 = pinhead:PINHD-1X2: PIN HEADER
J7 = pinhead:PINHD-2X10: PIN HEADER
J8 = pinhead:PINHD-2X3: PIN HEADER
J9-J12 = SparkFun-Passives:SOLDERJUMPER: Solder Jumper Standard SMD solder jumper. Used to automate production. Two varients : Normally Open and Normally Closed are the same, but have different paste layers. NC will have a large amount of paste and should jumper during reflow.
J13 = SparkFun-Passives:SOLDERJUMPER_2WAY: Solder Jumper 2 way solder jumper
J14 J15 = connector:TC2030-JLINK
J16 = connector:U.FL-R-SMT: U.FL-R-SMT Antenna Connector; DIGIKEY: H122041-ND
L1 = passives:INDUCTOR: A very specific inductor; DIGIKEY: 490-10596-1-ND; MOUSER: 81-1277AS-H-R47MP2
L2 L3 = signpost:LHQ3NP: LHQ3NP Inductor; DIGIKEY: 490-5350-1-ND
LOGO1 = logos:UMICH_SOLID
Q1 = fets:DMN32D2LDF: Common source dual n-channel mosfet; DIGIKEY: DMN32D2LDF-7DICT-ND
R1 R2 = passives:RESISTOR: Resistor Basic schematic elements and footprints for 0603, 1206, and PTH resistors.; DIGIKEY: 1276-3907-1-ND
R3 R4 = passives:RESISTOR: Resistor Basic schematic elements and footprints for 0603, 1206, and PTH resistors.; DIGIKEY: 1276-3429-1-ND
R5-R10 = passives:RESISTOR: Resistor Basic schematic elements and footprints for 0603, 1206, and PTH resistors.; DIGIKEY: 1276-3430-1-ND
R11-R16 R27 R28 = passives:RESISTOR: Resistor Basic schematic elements and footprints for 0603, 1206, and PTH resistors.; DIGIKEY: 1276-3431-1-ND
R17-R23 = passives:RESISTOR: Resistor Basic schematic elements and footprints for 0603, 1206, and PTH resistors.; DIGIKEY: 1276-3432-1-ND
R24-R26 = passives:RESISTOR: Resistor Basic schematic elements and footprints for 0603, 1206, and PTH resistors.; DIGIKEY: 1276-3433-1-ND
SW1 = switches:B3U: Switch; DIGIKEY: SW1020CT-ND
SW2 = switches:PTS810SJ: PTS810SJ Push Button Switch; DIGIKEY: CKN10504CT-ND
SW3-SW5 = signpost:SIP3240X: High power (2.4 A) high-side switch; DIGIKEY: SIP32402ADNP-T1GE4CT-ND
U1 = chips:FM25: Cypress FRAM; DIGIKEY: FM25CL64B-DGRA-ND
U2 = chips:FTDI234XD: FTDI234XD USB to UART Bridge in 3x3 DFN Package; DIGIKEY: 768-1178-1-ND; MOUSER: 895-FT234XD-R; NEWARK: 53X3171
U3 = chips:RXM-GPS-RM-T: The RM Series GPS receiver module is a self-contained high-performance Global Positioning System receiver; DIGIKEY: RXM-GPS-RM-TCT-ND
U4 U5 = chips:SAM4LC8BA: SAM4L Microcontroller. 64QFN Package. 512 Flash.; DIGIKEY: ATSAM4LC8BA-MURCT-ND
U6 = chips:SN74LVC1G125: Single Bus Buffer Gate with 3-state output; DIGIKEY: 296-11603-1-nd
U7 = signpost:TS3USB30E: USB Mux with OE control and ESD; DIGIKEY: 296-24684-1-ND
U8 = chips:TXS0108E: TXS0108E 8-Bit Bi-directional Voltage Translator; DIGIKEY: 296-24806-1-ND
VR1 = regulators:TPS62086: Buck Switching Regulator IC Positive Fixed 3.3V 1 Output 3A 7-VFDFN; DIGIKEY: 296-40831-1-ND
X1 X2 = crystals:FH1600015: Pericom Type FH 16 MHz 2.5 x 2.0 mm; DIGIKEY: FH1600015CT-ND